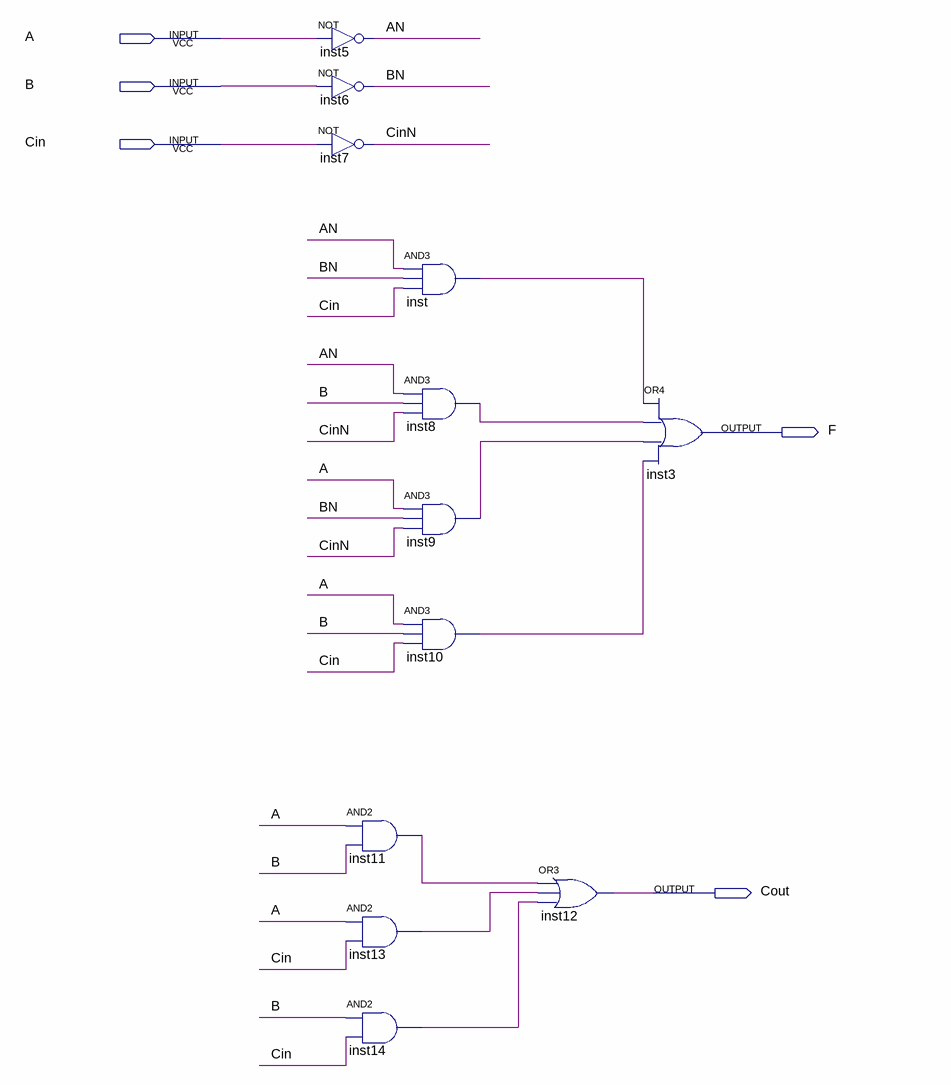
[diagram p0: schematic sheet]
// Quartus schematic 1_bit_adder.bdf as structural Verilog: 12 symbols, 5 pins
module \1_bit_adder  (
  input  A,
  input  B,
  input  Cin,
  output F,
  output Cout
);

  wire AN, BN, CinN, inst8_out, inst9_out, inst10_out, inst11_out, inst13_out, inst14_out, inst_out;

  not inst5 (AN, A);
  not inst6 (BN, B);
  not inst7 (CinN, Cin);
  and inst11 (inst11_out, A, B);
  and inst13 (inst13_out, A, Cin);
  and inst14 (inst14_out, B, Cin);
  and inst (inst_out, AN, BN, Cin);
  and inst8 (inst8_out, AN, B, CinN);
  and inst9 (inst9_out, A, BN, CinN);
  and inst10 (inst10_out, A, B, Cin);
  or inst12 (Cout, inst11_out, inst13_out, inst14_out);
  or inst3 (F, inst_out, inst8_out, inst9_out, inst10_out);
endmodule
